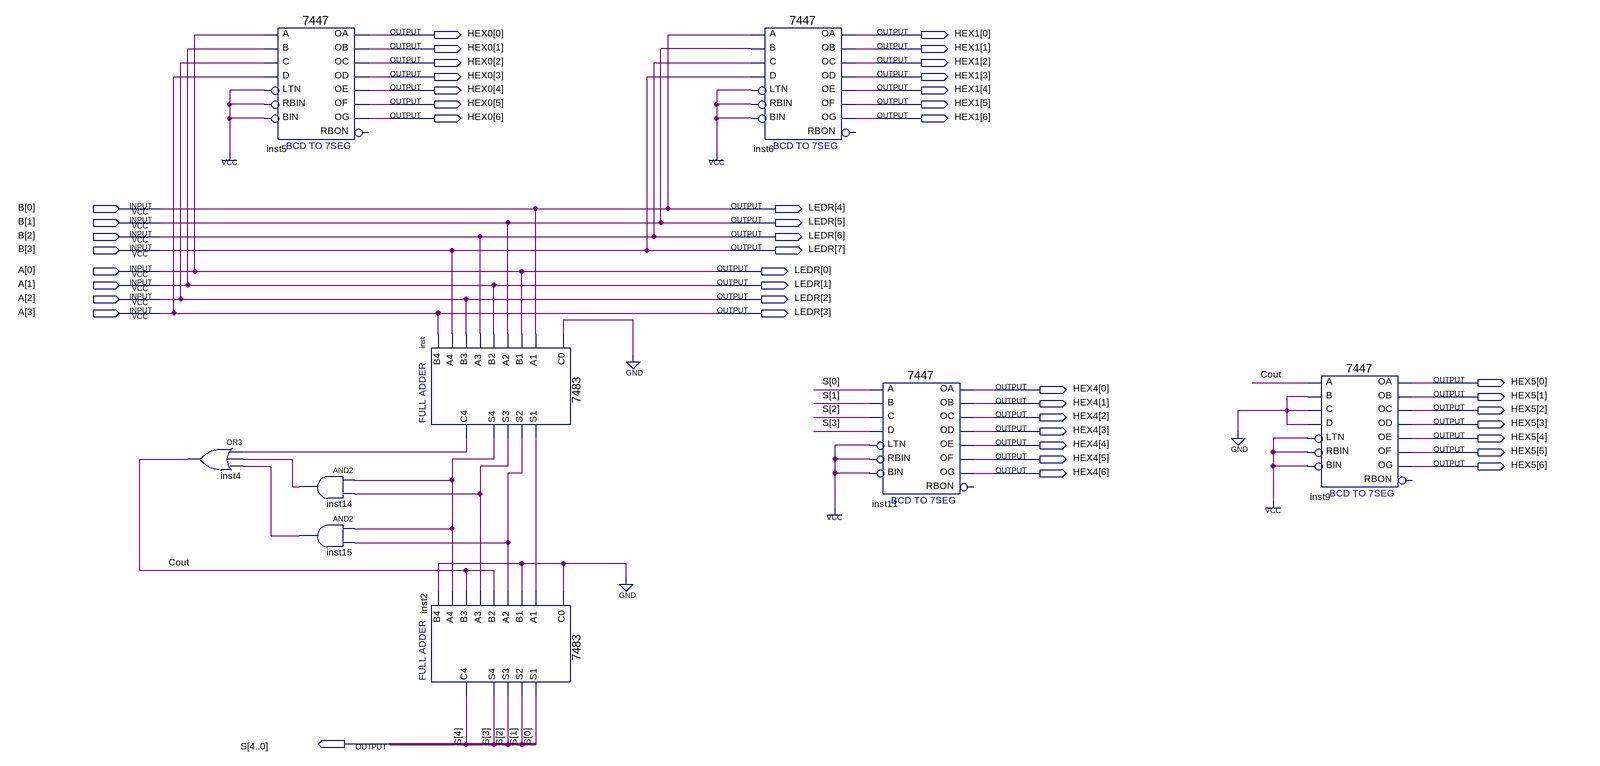
[diagram p0: schematic sheet]
// Quartus schematic FA4bits_with_7483.bdf as structural Verilog: 9 symbols, 45 pins
module FA4bits_with_7483 (
  input  [3:0] B,
  input  [3:0] A,
  output [6:0] HEX0,
  output [6:0] HEX1,
  output [7:0] LEDR,
  output [6:0] HEX5,
  output [6:0] HEX4,
  output [4:0] S
);

  wire Cout, inst14_out, inst15_out, inst_c4, inst_s1, inst_s2, inst_s3, inst_s4;

  or inst4 (Cout, inst_c4, inst14_out, inst15_out);
  \7447  inst5 (
    .LTN(1'b1), .B(A[1]), .C(A[2]), .D(A[3]), .RBIN(1'b1), .BIN(1'b1), .A(A[0]), .OB(HEX0[1]), .OC(HEX0[2]),
    .OE(HEX0[4]), .OD(HEX0[3]), .OF(HEX0[5]), .OG(HEX0[6]), .OA(HEX0[0]));  // open: RBON
  and inst14 (inst14_out, inst_s4, inst_s3);
  and inst15 (inst15_out, inst_s4, inst_s2);
  \7483  inst (
    .B4(A[3]), .C0(1'b0), .A1(B[0]), .A2(B[1]), .B1(A[0]), .B2(A[1]), .A3(B[2]), .B3(A[2]), .A4(B[3]),
    .S3(inst_s3), .S4(inst_s4), .S2(inst_s2), .C4(inst_c4), .S1(inst_s1));
  \7483  inst2 (
    .B4(1'b0), .C0(1'b0), .A1(inst_s1), .A2(inst_s2), .B1(1'b0), .B2(Cout), .A3(inst_s3), .B3(Cout),
    .A4(inst_s4), .S3(S[2]), .S4(S[3]), .S2(S[1]), .C4(S[4]), .S1(S[0]));
  \7447  inst6 (
    .LTN(1'b1), .B(B[1]), .C(B[2]), .D(B[3]), .RBIN(1'b1), .BIN(1'b1), .A(B[0]), .OB(HEX1[1]), .OC(HEX1[2]),
    .OE(HEX1[4]), .OD(HEX1[3]), .OF(HEX1[5]), .OG(HEX1[6]), .OA(HEX1[0]));  // open: RBON
  \7447  inst11 (
    .LTN(1'b1), .B(S[1]), .C(S[2]), .D(S[3]), .RBIN(1'b1), .BIN(1'b1), .A(S[0]), .OB(HEX4[1]), .OC(HEX4[2]),
    .OE(HEX4[4]), .OD(HEX4[3]), .OF(HEX4[5]), .OG(HEX4[6]), .OA(HEX4[0]));  // open: RBON
  \7447  inst9 (
    .LTN(1'b1), .B(1'b0), .C(1'b0), .D(1'b0), .RBIN(1'b1), .BIN(1'b1), .A(Cout), .OB(HEX5[1]), .OC(HEX5[2]),
    .OE(HEX5[4]), .OD(HEX5[3]), .OF(HEX5[5]), .OG(HEX5[6]), .OA(HEX5[0]));  // open: RBON

  assign LEDR = {B, A};
endmodule
